# Altium schematic sheet [02] - MCU.SchDoc
size A4
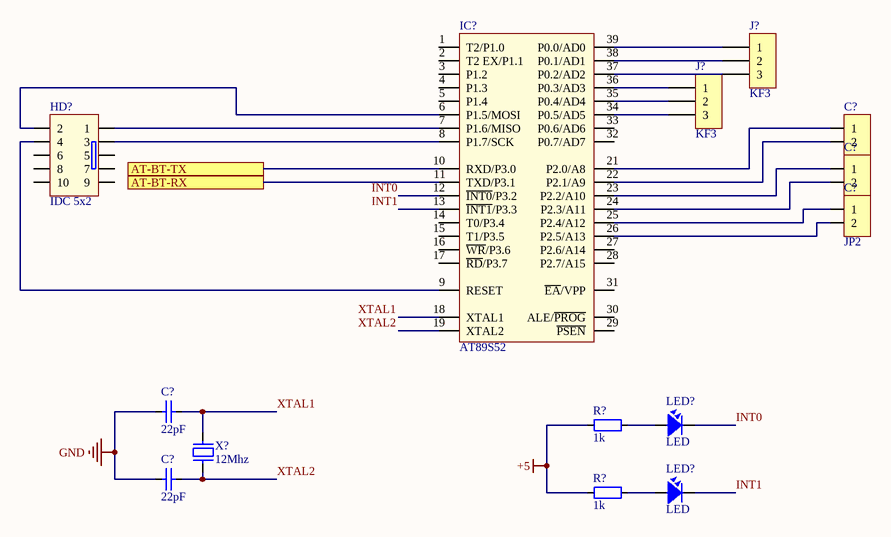
[diagram p0: [02] - MCU.SchDoc]

## Parts
(Parts that share a designator on the sheet are numbered #1, #2 ... from top to bottom, then left to right.)
C?#1  JP2  [JP2-C1T]
C?#2  JP2  [JP2-C1T]
C?#3  JP2  [JP2-C1T]
C?#4  22pF  [CAP_0402]
C?#5  22pF  [CAP_0402]
HD?  IDC 5x2  [IDC10-BH]
IC?  AT89S52  [DIP40/W0.6]
J?#1  KF3  [KF3-5.08T]
J?#2  KF3  [KF3-5.08T]
LED?#1  LED  [LED-3]
LED?#2  LED  [LED-3]
R?#1  1k  [RES-SMD-0402]
R?#2  1k  [RES-SMD-0402]
X?  12Mhz  [XT2]

## Ports
AT-BT-RX, AT-BT-TX

## Nets
+5: R?#1.1 R?#2.1
GND: C?#4.1 C?#5.1 IC?.20(GND)
VCC: IC?.40(VCC)
AT-BT-RX: IC?.11(TXD/P3.1) ; port AT-BT-RX
AT-BT-TX: IC?.10(RXD/P3.0) ; port AT-BT-TX
INT0: LED?#1.2
INT1: LED?#2.2
XTAL1: C?#4.2 X?.2
XTAL2: C?#5.2 X?.1
NetC?#1_1: C?#1.1 IC?.21(P2.0/A8)
NetC?#1_2: C?#1.2 IC?.22(P2.1/A9)
NetC?#2_1: C?#2.1 IC?.23(P2.2/A10)
NetC?#2_2: C?#2.2 IC?.24(P2.3/A11)
NetC?#3_1: C?#3.1 IC?.25(P2.4/A12)
NetC?#3_2: C?#3.2 IC?.26(P2.5/A13)
NetHD?_1: HD?.1 IC?.7(P1.6/MISO)
NetHD?_2: HD?.2 IC?.6(P1.5/MOSI)
NetHD?_3: HD?.3 IC?.8(P1.7/SCK)
NetHD?_4: HD?.4 IC?.9(RESET)
NetIC?_34: IC?.34(P0.5/AD5) J?#2.3
NetIC?_35: IC?.35(P0.4/AD4) J?#2.2
NetIC?_36: IC?.36(P0.3/AD3) J?#2.1
NetIC?_37: IC?.37(P0.2/AD2) J?#1.3
NetIC?_38: IC?.38(P0.1/AD1) J?#1.2
NetIC?_39: IC?.39(P0.0/AD0) J?#1.1
NetLED?#1_1: LED?#1.1 R?#1.2
NetLED?#2_1: LED?#2.1 R?#2.2

Not connected (* = marked no-connect by the designer): HD? 5 6 7 8 9 10; IC? 1(T2/P1.0) 2(T2_EX/P1.1) 3(P1.2) 4(P1.3) 5(P1.4) 12(~{INT0}/P3.2) 13(~{INT1}/P3.3) 14(T0/P3.4) 15(T1/P3.5) 16(~{WR}/P3.6) 17(~{RD}/P3.7) 18(XTAL1) 19(XTAL2) 27(P2.6/A14) 28(P2.7/A15) 29(~{PSEN}) 30(ALE/~{PROG}) 31(~{EA}/VPP) 32(P0.7/AD7) 33(P0.6/AD6)

## Notes on the sheet
- Labels drawn without touching a wire or pin: INT0, INT1, XTAL1, XTAL2
- Title
- Size:
- Date:
- A4
- Number:
- Time:
- Revision:
- Sheet
- of
- File:

## Library data of the parts
C?#1-C?#3 = JP2: WR-PHD 2.54 mm Angled Socket Header; Manufacturer: W¨¹rth Elektronik eiSos GmbH; partNo: 613002143121; ComponentLink1 Description: Manufacturer; ComponentLink2 Description: Datasheet; NoPins: 02; Created Date: 29 March 2013; ComponentLink1URL: http://www.we-online.com; ComponentLink2URL: http://katalog.we-online.de/em/datasheet/6130xx143121.pdf; Created by: Karrer Zheng
C?#4 C?#5 = CapSMD: Capacitor; Value: 33p; Published: 8-Jun-2000; LatestRevisionDate: 17-Jul-2002; LatestRevisionNote: Re-released for DXP Platform.; PackageReference: RAD-0.3; Publisher: Altium Limited
HD? = IDC 5X2: Value: Header 5x2
IC? = AT89S52: AT89S52, 8k Byte Flash Memory , 40 Pin; Value: AT89S52
J?#1 J?#2 = KF3: Manufacturer: Würth Elektronik eiSos GmbH; partNo: 691103110003; ComponentLink1 Description: Manufacturer; ComponentLink2 Description: Datasheet; NoPins: 3; Created Date: 29 October 2013; ComponentLink1URL: http://www.we-online.com; ComponentLink2URL: http://katalog.we-online.de/em/datasheet/6911031100xx.pdf; Created by: Karrer Zheng
LED?#1 LED?#2 = LED: LED Single colour Green and Red; Value: LED 3 ly Single Colour
R?#1 R?#2 = Resistor - SMD: Resistor; Manufacturer: Generic Components; Class: Passive; Published: 08/06/2000; Publisher: Altium Hobart Technology Centre
X? = XT2: Crystal For all Crystal 2pin.; Value: 4Mhz